# EAGLE design Quad-4layerV2 (EAGLE 9.5.2)
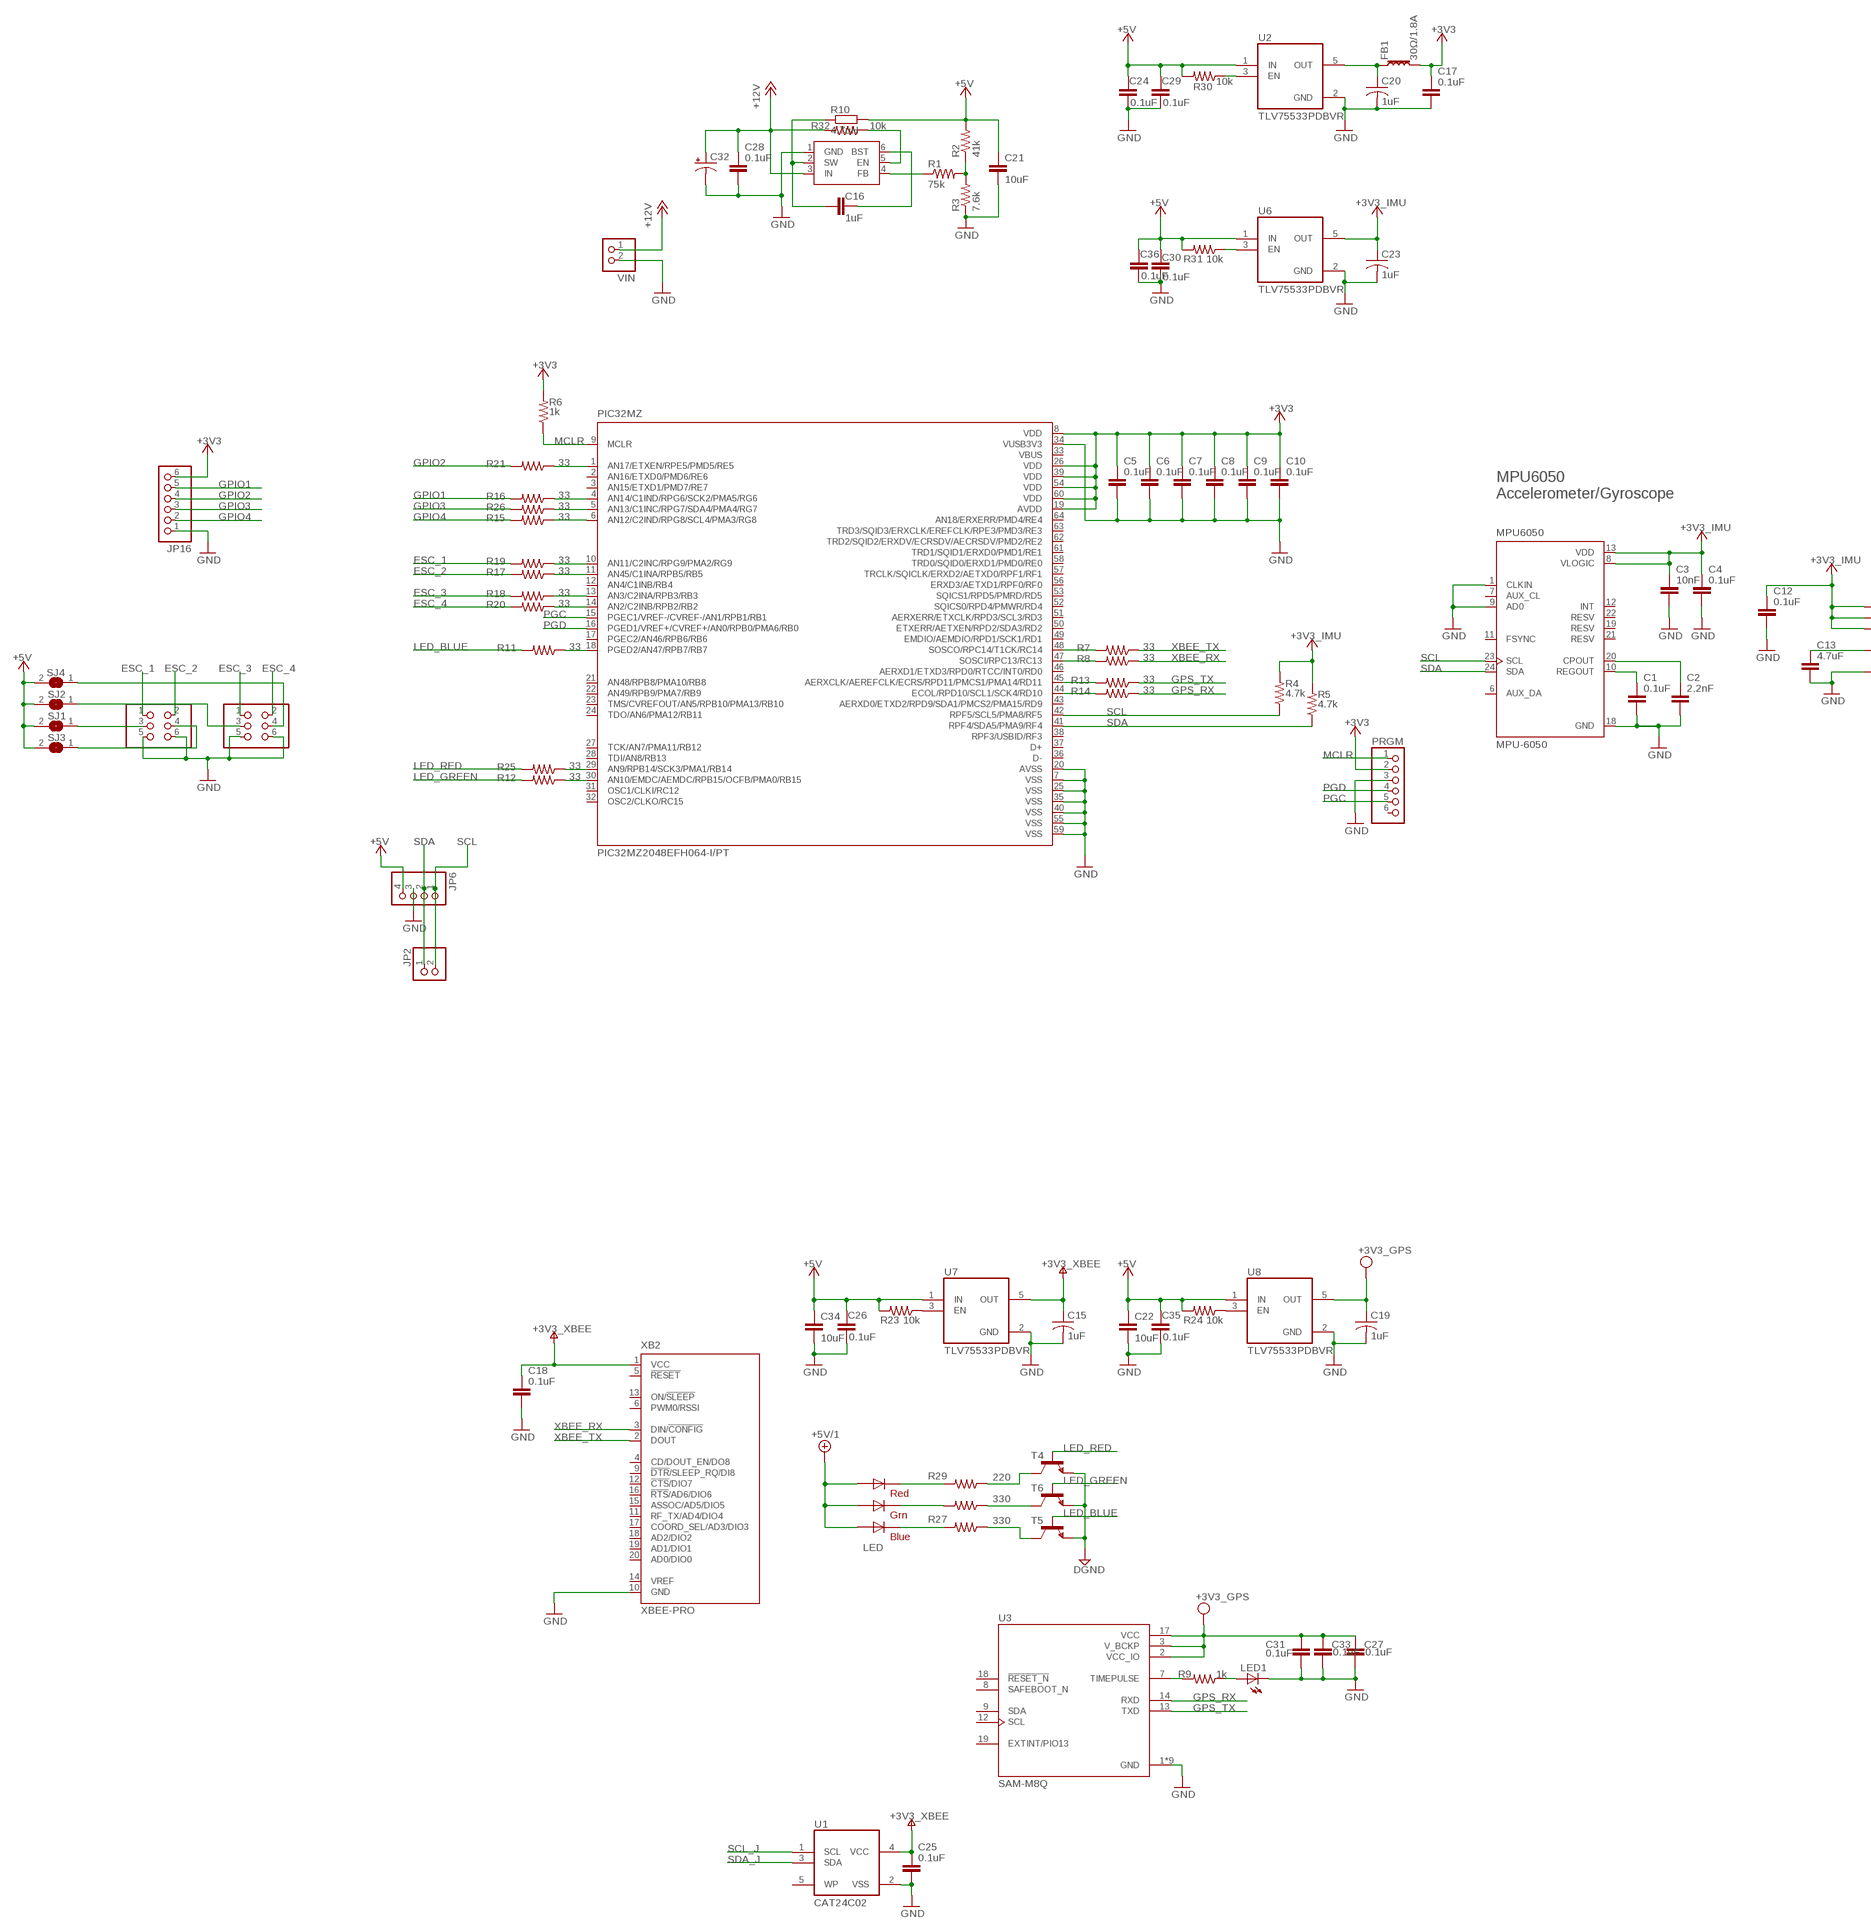
[diagram p0: schematic, sheet 1, part 1 of 2]
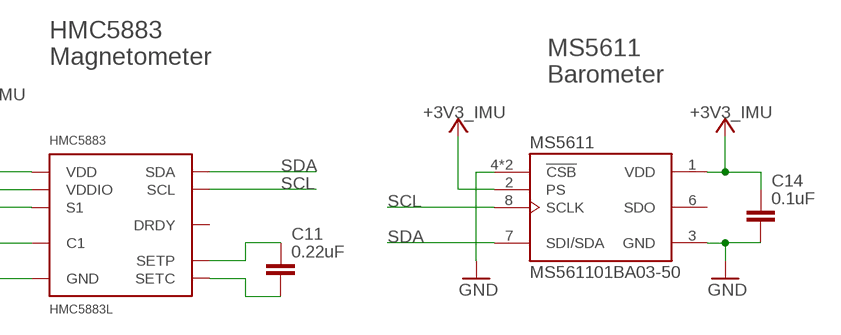
[diagram p1: schematic, sheet 1, part 2 of 2]

## Parts
C1  0.1uF  C-EUC0603  [C0603]
C2  2.2nF  C-EUC0603  [C0603]
C3  10nF  C-EUC0603  [C0603]
C4  0.1uF  C-EUC0603  [C0603]
C5  0.1uF  C-EUC0603  [C0603]
C6  0.1uF  C-EUC0603  [C0603]
C7  0.1uF  C-EUC0603  [C0603]
C8  0.1uF  C-EUC0603  [C0603]
C9  0.1uF  C-EUC0603  [C0603]
C10  0.1uF  C-EUC0603  [C0603]
C11  0.22uF  C-EUC0603  [C0603]
C12  0.1uF  C-EUC0603  [C0603]
C13  4.7uF  C-EUC0603  [C0603]
C14  0.1uF  C-EUC0603  [C0603]
C15  1uF  C-USC0805  [C0805]
C16  1uF  C-EUC0603  [C0603]
C17  0.1uF  C-EUC0603  [C0603]
C18  0.1uF  C-EUC0603  [C0603]
C19  1uF  C-USC0805  [C0805]
C20  1uF  C-USC0805  [C0805]
C21  10uF  C-EUC1206  [C1206]
C22  10uF  C-EUC1206  [C1206]
C23  1uF  C-USC0805  [C0805]
C24  0.1uF  C-EUC0603  [C0603]
C25  0.1uF  C-EUC0603  [C0603]
C26  0.1uF  C-EUC0603  [C0603]
C27  0.1uF  C-EUC0603  [C0603]
C28  0.1uF  C-EUC0603  [C0603]
C29  0.1uF  C-EUC0603  [C0603]
C30  0.1uF  C-EUC0603  [C0603]
C31  0.1uF  C-EUC0603  [C0603]
C32  CPOL-US085CS-1AR  [085CS_1AR]
C33  0.1uF  C-EUC0603  [C0603]
C34  10uF  C-EUC1206  [C1206]
C35  0.1uF  C-EUC0603  [C0603]
C36  0.1uF  C-EUC0603  [C0603]
FB1  30Ω/1.8A  FERRITE_BEAD-0603  [0603]
HMC5883  HMC5883L  [LPCC-16]
JP2  PINHD-1X2  [1X02]
JP4  PINHD-2X3  [2X03]
JP5  PINHD-2X3  [2X03]
JP6  PINHD-1X4  [1X04]
JP16  PINHD-1X6  [1X06]
LED  RGBLED5050  [RGBLED5050]
LED1  LEDCHIPLED_0603  [CHIPLED_0603]
MPU6050  MPU-6050  [QFN50P400X400X95-24N]
MS5611  MS561101BA03-50  [SON125P500X300X100-8N]
PIC32MZ  PIC32MZ2048EFH064-I/PT  [QFP50P1200X1200X120-64N]
PRGM  PINHD-1X6  [1X06]
R1  75k  R-US_R0603  [R0603]
R2  41k  R-US_R0603  [R0603]
R3  7.6k  R-US_R0603  [R0603]
R4  4.7k  R-US_R0603  [R0603]
R5  4.7k  R-US_R0603  [R0603]
R6  1k  R-US_R0603  [R0603]
R7  33  R-US_R0603  [R0603]
R8  33  R-US_R0603  [R0603]
R9  1k  R-US_R0603  [R0603]
R10  4.7uH  R-EU_R1210  [R1210]
R11  33  R-US_R0603  [R0603]
R12  33  R-US_R0603  [R0603]
R13  33  R-US_R0603  [R0603]
R14  33  R-US_R0603  [R0603]
R15  33  R-US_R0603  [R0603]
R16  33  R-US_R0603  [R0603]
R17  33  R-US_R0603  [R0603]
R18  33  R-US_R0603  [R0603]
R19  33  R-US_R0603  [R0603]
R20  33  R-US_R0603  [R0603]
R21  33  R-US_R0603  [R0603]
R23  10k  R-US_R0603  [R0603]
R24  10k  R-US_R0603  [R0603]
R25  33  R-US_R0603  [R0603]
R26  33  R-US_R0603  [R0603]
R27  330  R-US_R0603  [R0603]
R28  330  R-US_R0603  [R0603]
R29  220  R-US_R0603  [R0603]
R30  10k  R-US_R0603  [R0603]
R31  10k  R-US_R0603  [R0603]
R32  10k  R-US_R0603  [R0603]
SJ1  SJ  [SJ]
SJ2  SJ  [SJ]
SJ3  SJ  [SJ]
SJ4  SJ  [SJ]
T4  -NPN-SOT23-EBC  [SOT23-EBC]
T5  -NPN-SOT23-EBC  [SOT23-EBC]
T6  -NPN-SOT23-EBC  [SOT23-EBC]
U1  CAT24C02  [SOT95P280X145-5N]
U2  TLV75533PDBVR  [SOT95P280X145-5N]
U3  SAM-M8Q  [XCVR_SAM-M8Q]
U6  TLV75533PDBVR  [SOT95P280X145-5N]
U7  TLV75533PDBVR  [SOT95P280X145-5N]
U8  TLV75533PDBVR  [SOT95P280X145-5N]
U$2  AP65211A  [SOT95P280X140-6N]
VIN  JST_2PIN-THM-RA  [JST-PH-2-THM-RA]
XB2  XBEE-PRO  [XBEE-PRO]

## Nets
+3V3: C5.1 C6.1 C7.1 C8.1 C9.1 C10.1 C17.1 FB1.2 JP16.6 PIC32MZ.8(VDD) PIC32MZ.19(AVDD) PIC32MZ.26(VDD) PIC32MZ.39(VDD) PIC32MZ.54(VDD) PIC32MZ.60(VDD) PRGM.2 R6.2
+5V: C21.1 C22.1 C24.1 C26.1 C29.1 C30.1 C34.1 C35.1 C36.1 JP6.4 R2.2 R10.2 R23.2 R24.2 R30.2 R31.2 SJ1.2 SJ2.2 SJ3.2 SJ4.2 U2.1(IN) U6.1(IN) U7.1(IN) U8.1(IN)
+5V/1: LED.1(GREEN_A) LED.2(RED_A) LED.3(BLUE_A)
+12V: C28.1 C32.+ R32.2 U$2.3(IN) VIN.1
DGND: T4.E T5.E T6.E
ESC_1: JP5.1 R19.2
ESC_2: JP5.2 R17.2
ESC_3: JP4.1 R18.2
ESC_4: JP4.2 R20.2
GND: C1.2 C2.2 C3.2 C4.2 C5.2 C6.2 C7.2 C8.2 C9.2 C10.2 C12.2 C13.2 C14.2 C15.2 C17.2 C18.2 C19.2 C20.2 C21.2 C22.2 C23.2 C24.2 C25.2 C26.2 C27.2 C28.2 C29.2 C30.2 C31.2 C32.- C33.2 C34.2 C35.2 C36.2 HMC5883.9(GND) HMC5883.11(GND) JP4.5 JP4.6 JP5.5 JP5.6 JP6.3 JP16.1 LED1.C MPU6050.1(CLKIN) MPU6050.9(AD0) MPU6050.18(GND) MS5611.3(GND) MS5611.4(!CSB) MS5611.5(!CSB) PIC32MZ.7(VSS) PIC32MZ.20(AVSS) PIC32MZ.25(VSS) PIC32MZ.34(VUSB3V3) PIC32MZ.35(VSS) PIC32MZ.40(VSS) PIC32MZ.55(VSS) PIC32MZ.59(VSS) PRGM.3 R3.1 U1.2(VSS) U2.2(GND) U3.1(GND) U3.4(GND) U3.5(GND) U3.6(GND) U3.10(GND) U3.11(GND) U3.15(GND) U3.16(GND) U3.20(GND) U6.2(GND) U7.2(GND) U8.2(GND) U$2.1(GND) VIN.2 XB2.10(GND)
GPIO1: JP16.5 R16.2
GPIO2: JP16.4 R21.2
GPIO3: JP16.3 R26.2
GPIO4: JP16.2 R15.2
GPS_RX: R14.1 U3.14(RXD)
GPS_TX: R13.1 U3.13(TXD)
LED_BLUE: R11.2 T5.B
LED_GREEN: R12.2 T6.B
LED_RED: R25.2 T4.B
MCLR: PIC32MZ.9(MCLR) PRGM.1 R6.1
N$1: C1.1 MPU6050.10(REGOUT)
N$2: C2.1 MPU6050.20(CPOUT)
N$3: C11.1 HMC5883.8(SETP)
N$4: C11.2 HMC5883.12(SETC)
N$5: LED.5(RED_C) R29.2
N$6: C13.1 HMC5883.10(C1)
N$7: LED.6(GREEN_C) R28.2
N$8: C16.1 R10.1 U$2.2(SW)
N$9: C16.2 U$2.6(BST)
N$10: R1.1 U$2.4(FB)
N$11: R1.2 R2.1 R3.2
N$12: PIC32MZ.48(SOSCO/RPC14/T1CK/RC14) R7.2
N$13: PIC32MZ.47(SOSCI/RPC13/RC13) R8.2
N$14: R9.2 U3.7(TIMEPULSE)
N$15: LED.4(BLUE_C) R27.2
N$16: LED1.A R9.1
N$17: PIC32MZ.18(PGED2/AN47/RPB7/RB7) R11.1
N$18: PIC32MZ.45(AERXCLK/AEREFCLK/ECRS/RPD11/PMCS1/PMA14/RD11) R13.2
N$19: PIC32MZ.44(ECOL/RPD10/SCL1/SCK4/RD10) R14.2
N$20: PIC32MZ.29(AN9/RPB14/SCK3/PMA1/RB14) R25.1
N$21: PIC32MZ.4(AN14/C1IND/RPG6/SCK2/PMA5/RG6) R16.1
N$22: PIC32MZ.1(AN17/ETXEN/RPE5/PMD5/RE5) R21.1
N$23: PIC32MZ.11(AN45/C1INA/RPB5/RB5) R17.1
N$24: PIC32MZ.13(AN3/C2INA/RPB3/RB3) R18.1
N$25: PIC32MZ.10(AN11/C2INC/RPG9/PMA2/RG9) R19.1
N$26: PIC32MZ.14(AN2/C2INB/RPB2/RB2) R20.1
N$27: R23.1 U7.3(EN)
N$28: R24.1 U8.3(EN)
N$29: JP4.4 SJ4.1
N$30: PIC32MZ.5(AN13/C1INC/RPG7/SDA4/PMA4/RG7) R26.1
N$31: PIC32MZ.6(AN12/C2IND/RPG8/SCL4/PMA3/RG8) R15.1
N$32: R31.1 U6.3(EN)
N$33: R30.1 U2.3(EN)
N$34: PIC32MZ.30(AN10/EMDC/AEMDC/RPB15/OCFB/PMA0/RB15) R12.1
N$36: R32.1 U$2.5(EN)
N$39: C20.1 FB1.1 U2.5(OUT)
N$40: JP5.3 SJ1.1
N$41: JP4.3 SJ2.1
N$42: R28.1 T6.C
N$43: R29.1 T4.C
N$44: R27.1 T5.C
N$45: JP5.4 SJ3.1
PGC: PIC32MZ.15(PGEC1/VREF-/CVREF-/AN1/RPB1/RB1) PRGM.5
PGD: PIC32MZ.16(PGED1/VREF+/CVREF+/AN0/RPB0/PMA6/RB0) PRGM.4
SCL: HMC5883.1(SCL) JP2.2 JP6.1 MPU6050.23(SCL) MS5611.8(SCLK) PIC32MZ.42(RPF5/SCL5/PMA8/RF5) R4.1
SCL_J: U1.1(SCL)
SDA: HMC5883.16(SDA) JP2.1 JP6.2 MPU6050.24(SDA) MS5611.7(SDI/SDA) PIC32MZ.41(RPF4/SDA5/PMA9/RF4) R5.1
SDA_J: U1.3(SDA)
V+: C15.1 C18.1 C25.1 U1.4(VCC) U7.5(OUT) XB2.1(VCC) ; supply symbol labelled +3V3_XBEE
VCC: C3.1 C4.1 C12.1 C14.1 C23.1 HMC5883.2(VDD) HMC5883.4(S1) HMC5883.13(VDDIO) MPU6050.8(VLOGIC) MPU6050.13(VDD) MS5611.1(VDD) MS5611.2(PS) R4.2 R5.2 U6.5(OUT) ; supply symbol labelled +3V3_IMU
VDD: C19.1 C27.1 C31.1 C33.1 U3.2(VCC_IO) U3.3(V_BCKP) U3.17(VCC) U8.5(OUT) ; supply symbol labelled +3V3_GPS
XBEE_RX: R8.1 XB2.3(DIN/!CONFIG)
XBEE_TX: R7.1 XB2.2(DOUT)
Unconnected: HMC5883.15(DRDY) MPU6050.6(AUX_DA) MPU6050.7(AUX_CL) MPU6050.11(FSYNC) MPU6050.12(INT) MPU6050.19(RESV) MPU6050.21(RESV) MPU6050.22(RESV) MS5611.6(SDO) PIC32MZ.2(AN16/ETXD0/PMD6/RE6) PIC32MZ.3(AN15/ETXD1/PMD7/RE7) PIC32MZ.12(AN4/C1INB/RB4) PIC32MZ.17(PGEC2/AN46/RPB6/RB6) PIC32MZ.21(AN48/RPB8/PMA10/RB8) PIC32MZ.22(AN49/RPB9/PMA7/RB9) PIC32MZ.23(TMS/CVREFOUT/AN5/RPB10/PMA13/RB10) PIC32MZ.24(TDO/AN6/PMA12/RB11) PIC32MZ.27(TCK/AN7/PMA11/RB12) PIC32MZ.28(TDI/AN8/RB13) PIC32MZ.31(OSC1/CLKI/RC12) PIC32MZ.32(OSC2/CLKO/RC15) PIC32MZ.36(D-) PIC32MZ.37(D+) PIC32MZ.38(RPF3/USBID/RF3) PIC32MZ.43(AERXD0/ETXD2/RPD9/SDA1/PMCS2/PMA15/RD9) PIC32MZ.46(AERXD1/ETXD3/RPD0/RTCC/INT0/RD0) PIC32MZ.49(EMDIO/AEMDIO/RPD1/SCK1/RD1) PIC32MZ.50(ETXERR/AETXEN/RPD2/SDA3/RD2) PIC32MZ.51(AERXERR/ETXCLK/RPD3/SCL3/RD3) PIC32MZ.52(SQICS0/RPD4/PMWR/RD4) PIC32MZ.53(SQICS1/RPD5/PMRD/RD5) PIC32MZ.56(ERXD3/AETXD1/RPF0/RF0) PIC32MZ.57(TRCLK/SQICLK/ERXD2/AETXD0/RPF1/RF1) PIC32MZ.58(TRD0/SQID0/ERXD1/PMD0/RE0) PIC32MZ.61(TRD1/SQID1/ERXD0/PMD1/RE1) PIC32MZ.62(TRD2/SQID2/ERXDV/ECRSDV/AECRSDV/PMD2/RE2) PIC32MZ.63(TRD3/SQID3/ERXCLK/EREFCLK/RPE3/PMD3/RE3) PIC32MZ.64(AN18/ERXERR/PMD4/RE4) PRGM.6 U1.5(WP) U3.8(SAFEBOOT_N) U3.9(SDA) U3.12(SCL) U3.18(!RESET_N) U3.19(EXTINT/PIO13) XB2.4(CD/DOUT_EN/DO8) XB2.5(!RESET) XB2.6(PWM0/RSSI) XB2.9(!DTR!/SLEEP_RQ/DI8) XB2.11(RF_TX/AD4/DIO4) XB2.12(!CTS!/DIO7) XB2.13(ON/!SLEEP) XB2.14(VREF) XB2.15(ASSOC/AD5/DIO5) XB2.16(!RTS!/AD6/DIO6) XB2.17(COORD_SEL/AD3/DIO3) XB2.18(AD2/DIO2) XB2.19(AD1/DIO1) XB2.20(AD0/DIO0)

## Notes on the sheet
- MPU6050
  Accelerometer/Gyroscope
- HMC5883
  Magnetometer
- MS5611
  Barometer

## Power pins joined to a net without a drawn wire
VBUS: PIC32MZ.33(VBUS)

## Library data of the parts
C1-C14 C16-C18 C21 C22 C24-C31 C33-C36 = rcl:C-EU: CAPACITOR, European symbol; SPICEPREFIX: C
C15 C19 C20 C23 = rcl:C-US: CAPACITOR, American symbol; SPICEPREFIX: C
C32 = rcl:CPOL-US: POLARIZED CAPACITOR, American symbol; SPICEPREFIX: C
FB1 = SparkFun-Coils:FERRITE_BEAD: Ferrite Bead (blocks, cores, rings, chokes, etc.) Inductor with layers of ferrite used to suppress high frequencies. Often used to isolate high frequency noise. SparkFun Products: IOIO-OTG - V2.2 <https://www.sparkfun.com/products/13613> SparkFun SAMD21 Mini Breakout <https://www.sparkfun.com/products/13664> SparkFun 6 Degrees of Freedom Breakout - LSM6DS3 <https://www.sparkfun.com/products/13339> SparkFun SAMD21 Dev Breakout <https://www.sparkfun.com/products/13672>; PROD_ID: NDUC-07859
HMC5883 = HMC5883L:HMC5883L; AVAILABILITY: Unavailable; DESCRIPTION: Digital Compass +/- 0.8g, Lcc-16; MF: Honeywell Aerospace; MP: HMC5883L-T; PACKAGE: LCC-16 Honeywell; PRICE: None
JP2 = pinhead:PINHD-1X2: PIN HEADER
JP4 JP5 = pinhead:PINHD-2X3: PIN HEADER
JP6 = pinhead:PINHD-1X4: PIN HEADER
JP16 PRGM = pinhead:PINHD-1X6: PIN HEADER
LED = adafruit:RGBLED: For 5050 RGB LEDs, the order of the LEDs may vary from one manufacturer to another!
LED1 = adafruit:LED: LED OSRAM: - CHIPLED LG R971, LG N971, LY N971, LG Q971, LY Q971, LO R971, LY R971 LH N974, LH R974 LS Q976, LO Q976, LY Q976 LO Q996 - Hyper CHIPLED LW Q18S LB Q993, LB Q99A, LB R99A - SideLED LS A670, LO A670, LY A670, LG A670, LP A670 LB A673, LV A673, LT A673, LW A673 LH A674 LY A675 LS A676, LA A676, LO A676, LY A676, LW A676 LS A679, LY A679, LG A679 - Hyper Micro SIDELED® LS Y876, LA Y876, LO Y876, LY Y876 LT Y87S - SmartLED LW L88C, LW L88S LB L89C, LB L89S, LG L890 LS L89K, LO L89K, LY L89K LS L896, LA L896, LO L896, LY L896 - TOPLED LS T670, LO T670, LY T670, LG T670, LP T670 LSG T670, LSP T670, LSY T670, LOP T670, LYG T670 LG T671, LOG T671, LSG T671 LB T673, LV T673, LT T673, LW T673 LH T674 LS T676, LA T676, LO T676, LY T676, LB T676, LH T676, LSB T676, LW T676 LB T67C, LV T67C, LT T67C, LS T67K, LO T67K, LY T67K, LW E67C LS E67B, LA E67B, LO E67B, LY E67B, LB E67C, LV E67C, LT E67C LW T67C LS T679, LY T679, LG T679 LS T770, LO T770, LY T770, LG T770, LP T770 LB T773, LV T773, LT T773, LW T773 LH T774 LS E675, LA E675, LY E675, LS T675 LS T776, LA T776, LO T776, LY T776, LB T776 LHGB T686 LT T68C, LB T68C - Hyper Mini TOPLED® LB M676 - Mini TOPLED Santana® LG M470 LS M47K, LO M47K, LY M47K Source: http://www.osram.convergy.de/
MPU6050 = MPU-6050:MPU-6050: MPU-6050 Six-Axis (Gyro + Accelerometer) MEMS MotionTracking™ Devices; AVAILABILITY: Unavailable; DESCRIPTION: 3-axis gyroscope, 3-axis accelerometer in a 4x4x0.9 housing; MF: TDK InvenSense; MP: MPU-6050; PACKAGE: QFN-24 InvenSense; PRICE: None
MS5611 = MS561101BA03-50:MS561101BA03-50: BAROMETRIC PRESSURE SENSOR; AVAILABILITY: Unavailable; DESCRIPTION: Pressure Sensor 1.44V to 3.6V 0.01bar to 1.2bar Absolute 8-Pin QFN T/R; MF: TE Connectivity; MP: MS561101BA03-50; PACKAGE: SMD-8 Measurement Specialties; PRICE: None
PIC32MZ = PIC32MZ2048EFH064-I_PT:PIC32MZ2048EFH064-I/PT: PIC32MZ Series 2 MB Flash 512 kB RAM 200 MHz 32-Bit Microcontroller - TQFP-64; DESCRIPTION: PIC32MZ Series 2 MB Flash 512 kB RAM 200 MHz 32-Bit Microcontroller - TQFP-64; DIGI-KEY_PART_NUMBER: PIC32MZ2048EFH064-I/PT-ND; DIGI-KEY_PURCHASE_URL: https://www.digikey.com/product-detail/en/microchip-technology/PIC32MZ2048EFH064-I-PT/PIC32MZ2048EFH064-I-PT-ND/5323563?utm_source=snapeda&utm_medium=aggregator&utm_campaign=symbol; MF: Microchip; MP: PIC32MZ2048EFH064-I/PT; PACKAGE: TQFP-64 Microchip
R1-R9 R11-R21 R23-R32 = rcl:R-US_: RESISTOR, American symbol; SPICEPREFIX: R
R10 = rcl:R-EU_: RESISTOR, European symbol; SPICEPREFIX: R
SJ1-SJ4 = jumper:SJ: SMD solder JUMPER
T4-T6 = transistor:*-NPN-: NPN Transistror BF959 corrected 2008.03.06
U1 = CAT24C02:CAT24C02: 500mA Low-IQ Small-Size Low-Dropout (LDO) Regulator 5-SOT-23 -40 to 125; AVAILABILITY: Unavailable; DESCRIPTION: 500mA Low-IQ Small-Size Low-Dropout _LDO_ Regulator 5-SOT-23 -40 to 125; MF: Texas Instruments; MP: TLV75533PDBVR; PACKAGE: SOT-23 Texas Instruments; PRICE: None
U2 U6-U8 = TLV75533PDBVR:TLV75533PDBVR: 500mA Low-IQ Small-Size Low-Dropout (LDO) Regulator 5-SOT-23 -40 to 125; AVAILABILITY: Unavailable; DESCRIPTION: 500mA Low-IQ Small-Size Low-Dropout _LDO_ Regulator 5-SOT-23 -40 to 125; MF: Texas Instruments; MP: TLV75533PDBVR; PACKAGE: SOT-23 Texas Instruments; PRICE: None
U3 = SAM-M8Q:SAM-M8Q: u-blox SAM GNSS antenna module; AVAILABILITY: Unavailable; DESCRIPTION: u-Blox M8 Gnss Antenna Module; MF: U-Blox America; MP: SAM-M8Q; PACKAGE: SMD-20 U-Blox America; PRICE: None
U$2 = SOT95P280X140-6N:AP65211A
VIN = adafruit:JST_2PIN: JST 2-Pin Connectors of various flavors SMT-RA (S2B-PH-SM4) 4UConnector #17311 SMT (B2B-PH-SM4) THM-RA (S2B-PH) THM (B2B-PH)
XB2 = maxstream:XBEE: XBee (TM) /XBee-PRO(TM) OEM RF Modules Source: MaxStream, Inc. xbee_productmanual.pdf; MPN: XBP24-AWI-001; OC_FARNELL: 1337916; OC_NEWARK: 42M2667

## Board
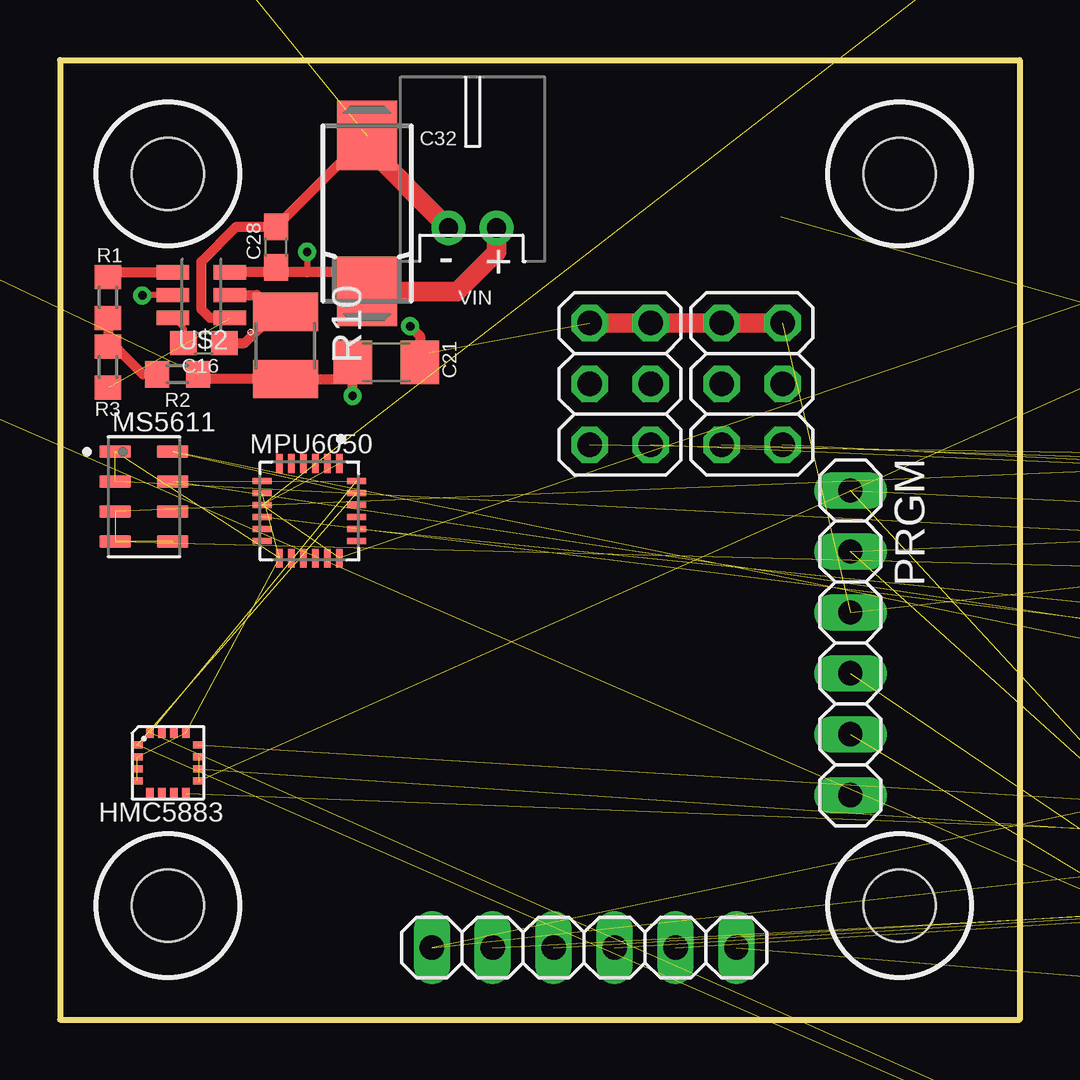
[diagram p2: board, top side]
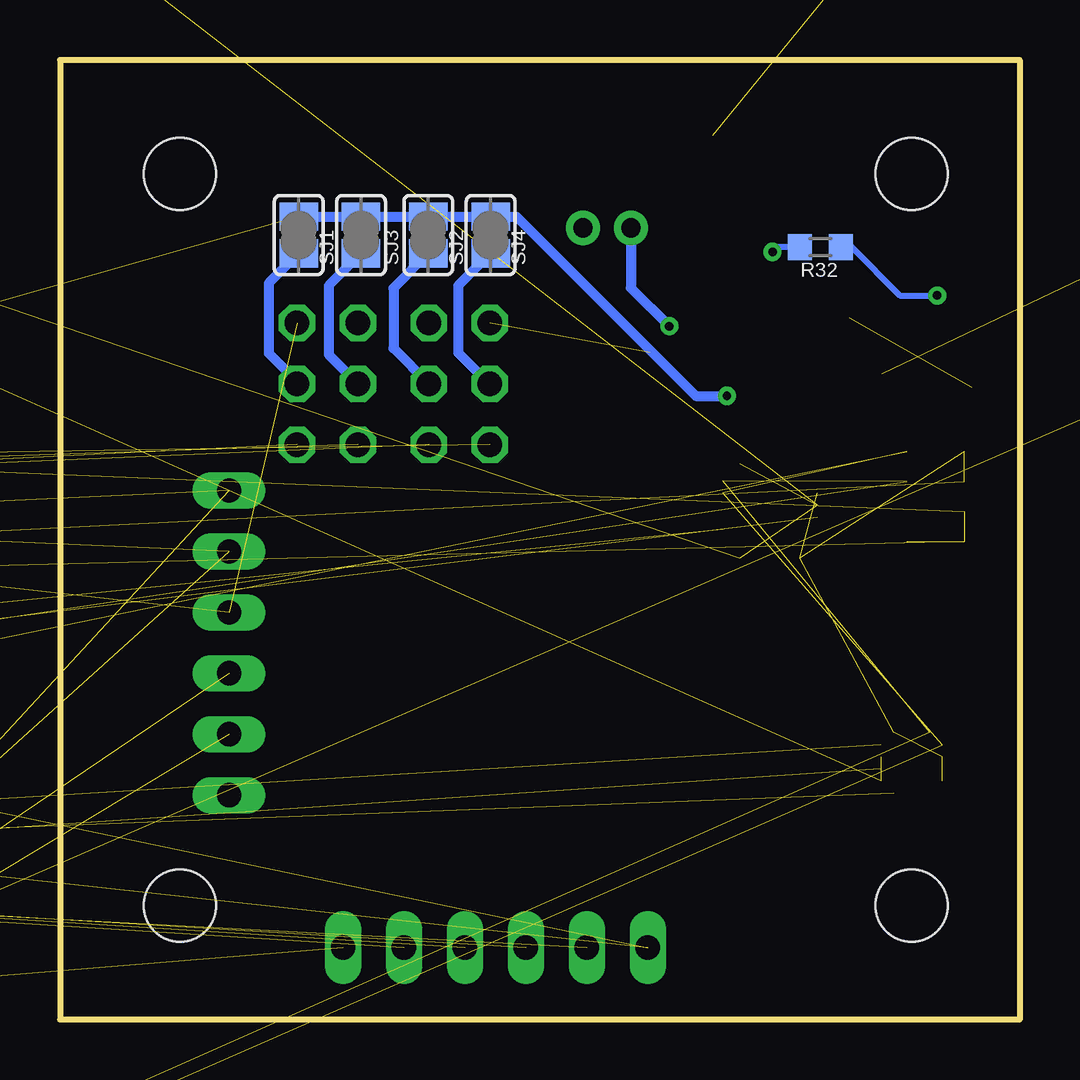
[diagram p3: board, bottom side, seen from below]

Size 40 x 40 mm. Coordinates in mm from the lower left corner, seen from the top.
Outline: 0,40 0,0 40,0 40,40 0,40
Copper layers (1*16): Top 0.035mm / dielectric 0.2mm / Bottom 0.035mm
Design rules "default *": minimum track width 6mil, minimum drill 0.35mm, track to track 6mil, track to pad 6mil, pad to pad 6mil, via to via 6mil, smd to smd 6mil, copper to edge 40mil, drill to drill 6mil, minimum pad ring 10mil, minimum via ring 8mil, stop-mask expansion 4mil, vias tented up to drill 0mil, thermal gap 10mil
Holes 3 mm at 4.5,4.75 4.5,35.25 35,4.75 35,35.25

### Footprints (pad centres in the part's own frame; a part is rotated, then mirrored left to right if it is on the bottom)
C0603 = smd 1.1 x 1: 1 -0.85,0; 2 0.85,0
C0805 = smd 1.3 x 1.5: 1 -0.95,0; 2 0.95,0
C1206 = smd 1.6 x 1.8: 1 -1.4,0; 2 1.4,0
085CS_1AR = smd 2.9 x 2.5: + 3.25,0; - -3.25,0
0603 = smd 1.1 x 1: 1 -0.85,0; 2 0.85,0
LPCC-16 = smd 0.45 x 0.3: 1 -1.275,0.75; 2 -1.275,0.25; 3 -1.275,-0.25; 4 -1.275,-0.75; 9 1.275,-0.75; 10 1.275,-0.25; 11 1.275,0.25; 12 1.275,0.75 | smd 0.3 x 0.45: 5 -0.75,-1.275; 6 -0.25,-1.275; 7 0.25,-1.275; 8 0.75,-1.275; 13 0.75,1.275; 14 0.25,1.275; 15 -0.25,1.275; 16 -0.75,1.275
1X02 = drill 1.016 long: 1 -1.27,0; 2 1.27,0
2X03 = drill 1.016 octagon: 1 -2.54,-1.27; 2 -2.54,1.27; 3 0,-1.27; 4 0,1.27; 5 2.54,-1.27; 6 2.54,1.27
1X04 = drill 1.016 long: 1 -3.81,0; 2 -1.27,0; 3 1.27,0; 4 3.81,0
1X06 = drill 1.016 long: 1 -6.35,0; 2 -3.81,0; 3 -1.27,0; 4 1.27,0; 5 3.81,0; 6 6.35,0
RGBLED5050 = smd 2 x 1.1: 1 -2,1.7; 2 -2,0; 3 -2,-1.7; 4 2,-1.7; 5 2,0; 6 2,1.7
CHIPLED_0603 = smd 0.8 x 0.8: A 0,-0.75; C 0,0.75
QFN50P400X400X95-24N = smd 0.79 x 0.26: 1 -1.97,1.25; 2 -1.97,0.75; 3 -1.97,0.25; 4 -1.97,-0.25; 5 -1.97,-0.75; 6 -1.97,-1.25; 13 1.97,-1.25; 14 1.97,-0.75; 15 1.97,-0.25; 16 1.97,0.25; 17 1.97,0.75; 18 1.97,1.25 | smd 0.26 x 0.79: 7 -1.25,-1.97; 8 -0.75,-1.97; 9 -0.25,-1.97; 10 0.25,-1.97; 11 0.75,-1.97; 12 1.25,-1.97; 19 1.25,1.97; 20 0.75,1.97; 21 0.25,1.97; 22 -0.25,1.97; 23 -0.75,1.97; 24 -1.25,1.97
SON125P500X300X100-8N = smd 1.31 x 0.53: 1 -1.2,1.875; 2 -1.2,0.625; 3 -1.2,-0.625; 4 -1.2,-1.875; 5 1.2,-1.875; 6 1.2,-0.625; 7 1.2,0.625; 8 1.2,1.875
QFP50P1200X1200X120-64N = smd 1.45 x 0.3: 1 -5.7,3.75; 2 -5.7,3.25; 3 -5.7,2.75; 4 -5.7,2.25; 5 -5.7,1.75; 6 -5.7,1.25; 7 -5.7,0.75; 8 -5.7,0.25; 9 -5.7,-0.25; 10 -5.7,-0.75; 11 -5.7,-1.25; 12 -5.7,-1.75; 13 -5.7,-2.25; 14 -5.7,-2.75; 15 -5.7,-3.25; 16 -5.7,-3.75; 33 5.7,-3.75; 34 5.7,-3.25; 35 5.7,-2.75; 36 5.7,-2.25; 37 5.7,-1.75; 38 5.7,-1.25; 39 5.7,-0.75; 40 5.7,-0.25; 41 5.7,0.25; 42 5.7,0.75; 43 5.7,1.25; 44 5.7,1.75; 45 5.7,2.25; 46 5.7,2.75; 47 5.7,3.25; 48 5.7,3.75 | smd 0.3 x 1.45: 17 -3.75,-5.7; 18 -3.25,-5.7; 19 -2.75,-5.7; 20 -2.25,-5.7; 21 -1.75,-5.7; 22 -1.25,-5.7; 23 -0.75,-5.7; 24 -0.25,-5.7; 25 0.25,-5.7; 26 0.75,-5.7; 27 1.25,-5.7; 28 1.75,-5.7; 29 2.25,-5.7; 30 2.75,-5.7; 31 3.25,-5.7; 32 3.75,-5.7; 49 3.75,5.7; 50 3.25,5.7; 51 2.75,5.7; 52 2.25,5.7; 53 1.75,5.7; 54 1.25,5.7; 55 0.75,5.7; 56 0.25,5.7; 57 -0.25,5.7; 58 -0.75,5.7; 59 -1.25,5.7; 60 -1.75,5.7; 61 -2.25,5.7; 62 -2.75,5.7; 63 -3.25,5.7; 64 -3.75,5.7
R0603 = smd 1 x 1.1: 1 -0.85,0; 2 0.85,0
R1210 = smd 1.6 x 2.7: 1 -1.4,0; 2 1.4,0
SJ = smd 1.168 x 1.6: 1 -0.762,0; 2 0.762,0
SOT23-EBC = smd 1 x 1.4: B 0.95,-1.1; C 0,1.1; E -0.95,-1.1
SOT95P280X145-5N = smd 1.21 x 0.59: 1 -1.255,0.95; 2 -1.255,0; 3 -1.255,-0.95; 4 1.255,-0.95; 5 1.255,0.95
XCVR_SAM-M8Q = smd 1.8 x 1.5: 1 -6.6,3.8; 2 -6.6,1.9; 3 -6.6,0; 4 -6.6,-1.9; 5 -6.6,-3.8; 11 6.6,-3.8; 12 6.6,-1.9; 13 6.6,0; 14 6.6,1.9; 15 6.6,3.8 | smd 1.5 x 1.8: 6 -3.8,-6.6; 7 -1.9,-6.6; 8 0,-6.6; 9 1.9,-6.6; 10 3.8,-6.6; 16 3.8,6.6; 17 1.9,6.6; 18 0,6.6; 19 -1.9,6.6; 20 -3.8,6.6
SOT95P280X140-6N = smd 1.35 x 0.6: 1 -1.185,0.95; 2 -1.185,0; 3 -1.185,-0.95; 4 1.185,-0.95; 5 1.185,0; 6 1.185,0.95
JST-PH-2-THM-RA = drill 0.8 pad 1.422: 1 1,0; 2 -1,0
XBEE-PRO = drill 0.8 pad 1.27: 1 -11,9; 2 -11,7; 3 -11,5; 4 -11,3; 5 -11,1; 6 -11,-1; 7 -11,-3; 8 -11,-5; 9 -11,-7; 10 -11,-9; 11 11,-9; 12 11,-7; 13 11,-5; 14 11,-3; 15 11,-1; 16 11,1; 17 11,3; 18 11,5; 19 11,7; 20 11,9

### Placement (x,y rotation side)
C1  101.3,10.3 90 top  (outside the outline)
C2  108.2,9.9 270 top  (outside the outline)
C3  101.3,13.3 270 top  (outside the outline)
C4  104.9,8.5 0 top  (outside the outline)
C5  63.55,-8.8 180 top  (outside the outline)
C6  46.65,-6.3 270 top  (outside the outline)
C7  53.95,0.1 0 top  (outside the outline)
C8  56.65,-15.5 180 top  (outside the outline)
C9  56.95,0.1 180 top  (outside the outline)
C10  52.65,-15.5 0 top  (outside the outline)
C11  100.4,5.7 180 top  (outside the outline)
C12  97.3,9.1 180 top  (outside the outline)
C13  101.8,3.1 270 top  (outside the outline)
C14  101.9,17.4 0 top  (outside the outline)
C15  -49.6,42.4 0 top  (outside the outline)
C16  6,28.2 180 top
C17  111.6,22.9 0 top  (outside the outline)
C18  -52.8,39.9 90 top  (outside the outline)
C19  111.9,-13.1 180 bottom  (outside the outline)
C20  112.5,26.5 90 top  (outside the outline)
C21  13.6,27.4 0 top
C22  110.9,-3.9 180 bottom  (outside the outline)
C23  97.3,10.7 180 top  (outside the outline)
C24  106.2,26.3 270 top  (outside the outline)
C25  -45.6,44.9 270 top  (outside the outline)
C26  -42,41.8 0 top  (outside the outline)
C27  79.5,26.7 270 top  (outside the outline)
C28  9,32.2 90 top
C29  107.6,26.3 270 top  (outside the outline)
C30  96.9,16.6 180 top  (outside the outline)
C31  79.5,30.4 90 top  (outside the outline)
C32  12.8,33.6 270 top
C33  68,20.8 180 top  (outside the outline)
C34  -41.7,48.9 0 top  (outside the outline)
C35  111.5,-6.6 180 bottom  (outside the outline)
C36  96.9,17.8 180 top  (outside the outline)
FB1  111.6,24.1 180 top  (outside the outline)
HMC5883  4.5,10.7 0 top
JP2  86.8,2.5 180 top  (outside the outline)
JP4  23.35,26.5 90 top
JP5  28.85,26.5 90 top
JP6  91.3,9.8 90 top  (outside the outline)
JP16  21.85,3 180 top
LED  32,68 90 top  (outside the outline)
LED1  75.7,41.4 270 top  (outside the outline)
MPU6050  10.4,21.2 270 top
MS5611  3.5,21.8 0 top
PIC32MZ  54.5,-7.75 180 top  (outside the outline)
PRGM  32.95,15.7 270 top
R1  2,30.1 270 top
R2  4.9,26.9 0 top
R3  2,27.2 90 top
R4  93.7,6.2 90 bottom  (outside the outline)
R5  95.25,7.9 270 bottom  (outside the outline)
R6  131.65,16.6 270 top  (outside the outline)
R7  114.35,6 90 top  (outside the outline)
R8  112.55,6 90 top  (outside the outline)
R9  72.7,38.7 270 top  (outside the outline)
R10  9.4,28.1 270 top
R11  123.35,27.1 90 top  (outside the outline)
R12  116.4,27.95 0 top  (outside the outline)
R13  110.85,6 90 top  (outside the outline)
R14  109.25,6 90 top  (outside the outline)
R15  127.95,10.3 270 top  (outside the outline)
R16  129.45,9.8 270 bottom  (outside the outline)
R17  128.05,19.8 90 bottom  (outside the outline)
R18  128.95,19.5 0 top  (outside the outline)
R19  130.35,19 180 bottom  (outside the outline)
R20  126.65,21.5 90 top  (outside the outline)
R21  123.6,9.15 0 bottom  (outside the outline)
R23  -53.7,52.3 270 top  (outside the outline)
R24  114.6,-8.9 180 bottom  (outside the outline)
R25  119.8,26.55 0 top  (outside the outline)
R26  125.85,10.3 270 top  (outside the outline)
R27  116.5,-10.5 270 top  (outside the outline)
R28  111.5,-10.6 270 top  (outside the outline)
R29  114.7,-12.4 270 top  (outside the outline)
R30  110,29.4 0 top  (outside the outline)
R31  92.7,15.9 180 top  (outside the outline)
R32  8.3,32.2 180 bottom
SJ1  30.05,32.7 90 bottom
SJ2  24.65,32.7 90 bottom
SJ3  27.45,32.7 90 bottom
SJ4  22.05,32.7 90 bottom
T4  114.4,-8.9 180 top  (outside the outline)
T5  118.9,-7.7 90 top  (outside the outline)
T6  111.5,-7.1 180 top  (outside the outline)
U1  -30.5,47.8 90 top  (outside the outline)
U2  110,26.7 270 top  (outside the outline)
U3  66.2,75.7 180 top  (outside the outline)
U6  96.2,14 270 top  (outside the outline)
U7  -37,49 90 top  (outside the outline)
U8  111.6,-9.9 270 bottom  (outside the outline)
U$2  5.9,30.2 180 top
VIN  17.2,33 0 top
XB2  9,64 0 top  (outside the outline)

### Tracks (layer width: path | path; a pad name or v marks a point on that pad's centre or on a via)
+3V3  (16 unrouted)
+5V  (via drill 0.35)  (17 unrouted)
  Top 0.406: R2.2 5.95,26.7 R10.2 11.5,26.7 C21.1 v12.2,26
  Bottom 0.406: SJ1.2 SJ3.2 SJ2.2 SJ4.2 20.96,33.46 13.5,26 v12.2,26
+5V/1  (2 unrouted)
+12V  (via drill 0.35)
  Top 0.254: v10.3,32 10.3,31.15
  Top 0.406: 12.8,31.15 10.3,31.15 9.2,31.15 | 9.2,31.15 U$2.3 | C28.1 9.2,31.15
  Top 0.813: 12.8,31.15 C32.+ 16.55,30.35 18.2,32 VIN.1
  Bottom 0.254: R32.2 10.1,32.2 v10.3,32
DGND  (2 unrouted)
ESC_1  (1 unrouted)
ESC_2  (1 unrouted)
ESC_3  (1 unrouted)
ESC_4  (1 unrouted)
GND  (via drill 0.35)  (68 unrouted)
  Top 0.406: 15.4,27.8 C21.2 15,28.5 v14.6,28.9 | C32.- C28.2 7.35,33.05 5.9,31.6 5.9,29.6 6.25,29.25 U$2.1
  Top 0.813: C32.- 12.8,36.4 VIN.2 | JP4.6 JP4.5 JP5.6 JP5.5
  Bottom 0.406: VIN.2 16.2,30.5 v14.6,28.9
GPIO1  (1 unrouted)
GPIO2  (1 unrouted)
GPIO3  (1 unrouted)
GPIO4  (1 unrouted)
GPS_RX  (1 unrouted)
GPS_TX  (1 unrouted)
LED_BLUE  (1 unrouted)
LED_GREEN  (1 unrouted)
LED_RED  (1 unrouted)
MCLR  (2 unrouted)
N$1  (1 unrouted)
N$2  (1 unrouted)
N$3  (1 unrouted)
N$4  (1 unrouted)
N$5  (1 unrouted)
N$6  (1 unrouted)
N$7  (1 unrouted)
N$8
  Top 0.406: U$2.2 8.2,30.2 8.75,29.65 | R10.1 8.9,29.5 8.75,29.65 | C16.1 7.7,28.2 8.75,29.25 8.75,29.65
N$9
  Top 0.254: U$2.6 5.15,28.81 C16.2
N$10
  Top 0.406: R1.1 2.2,31.15 U$2.4
N$11
  Top 0.406: R1.2 R3.2 2.3,28.05 3.45,26.9 R2.1
N$12  (1 unrouted)
N$13  (1 unrouted)
N$14  (1 unrouted)
N$15  (1 unrouted)
N$16  (1 unrouted)
N$17  (1 unrouted)
N$18  (1 unrouted)
N$19  (1 unrouted)
N$20  (1 unrouted)
N$21  (1 unrouted)
N$22  (1 unrouted)
N$23  (1 unrouted)
N$24  (1 unrouted)
N$25  (1 unrouted)
N$26  (1 unrouted)
N$27  (1 unrouted)
N$28  (1 unrouted)
N$29
  Bottom 0.406: SJ4.1 23.4,30.59 23.4,27.8 22.1,26.5 JP4.4
N$30  (1 unrouted)
N$31  (1 unrouted)
N$32  (1 unrouted)
N$33  (1 unrouted)
N$34  (1 unrouted)
N$36  (via drill 0.35)
  Top 0.254: U$2.5 3.45,30.2 v3.43,30.18
  Bottom 0.254: v3.43,30.18 4.98,30.18 7,32.2 R32.1
N$39  (2 unrouted)
N$40
  Bottom 0.406: SJ1.1 31.3,30.69 31.3,27.78 30.12,26.6 JP5.3
N$41
  Bottom 0.406: SJ2.1 26.1,30.49 26.1,27.98 JP4.3
N$42  (1 unrouted)
N$43  (1 unrouted)
N$44  (1 unrouted)
N$45
  Bottom 0.406: SJ3.1 28.8,30.59 28.8,27.72 JP5.4
PGC  (1 unrouted)
PGD  (1 unrouted)
SCL  (6 unrouted)
SDA  (6 unrouted)
V+  (5 unrouted)
VCC  (14 unrouted)
VDD  (7 unrouted)
XBEE_RX  (1 unrouted)
XBEE_TX  (1 unrouted)